# EAGLE design bread-supply_v0 (EAGLE 5.07)
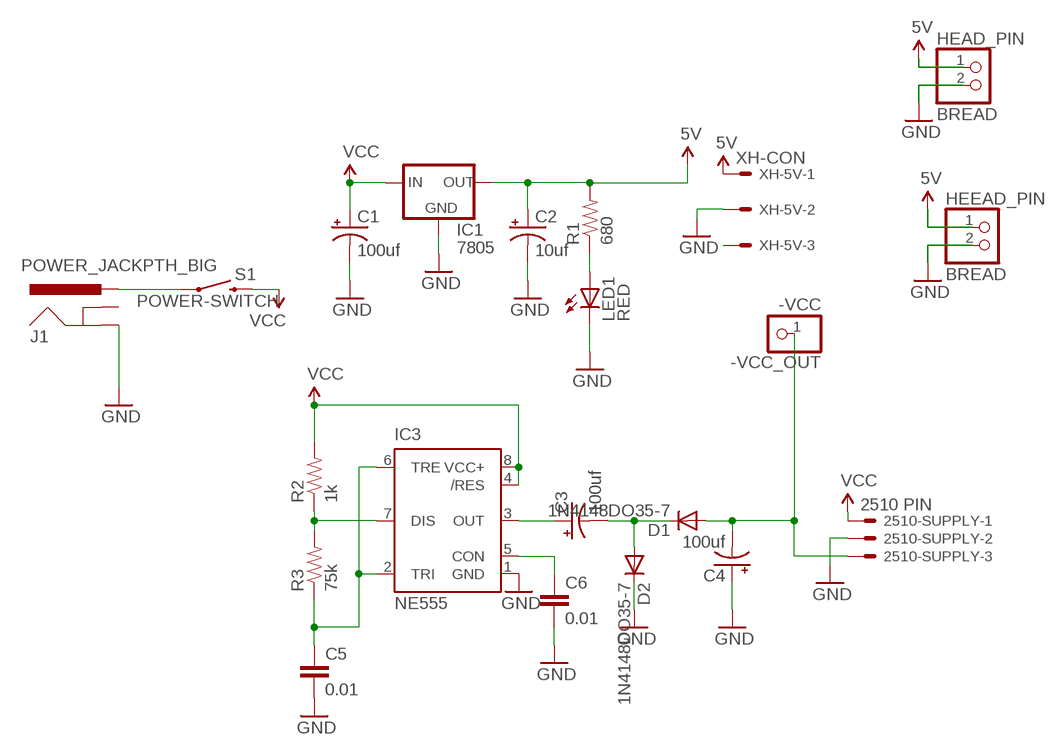
[diagram p0: schematic, sheet 1]

## Parts
2510-SUPPLY  2510 PIN  22-23-2031  [22-23-2031]
-VCC_OUT  -VCC  PINHD-1X1  [1X01]
C1  100uf  CAP_POLPTH1  [CPOL-RADIAL-100UF-25V]
C2  10uf  CAP_POLPTH2  [CPOL-RADIAL-10UF-25V]
C3  100uf  CAP_POLPTH1  [CPOL-RADIAL-100UF-25V]
C4  100uf  CAP_POLPTH1  [CPOL-RADIAL-100UF-25V]
C5  0.01  CAPPTH  [CAP-PTH-SMALL]
C6  0.01  CAPPTH  [CAP-PTH-SMALL]
D1  1N4148DO35-7  [DO35-7]
D2  1N4148DO35-7  [DO35-7]
HEAD_PIN  BREAD  PINHD-1X2  [1X02]
HEEAD_PIN  BREAD  PINHD-1X2  [1X02]
IC1  7805  V_REG_78XXSIDE  [78XXL]
IC3  NE555  [DIL-08]
J1  POWER_JACKPTH_BIG  [POWER_JACK_2.1X5.5_BIG_PTH]
LED1  RED  LED3MM  [LED3MM]
R1  680  RESISTORPTH1  [AXIAL-0.3]
R2  1k  RESISTORPTH1  [AXIAL-0.3]
R3  75k  RESISTORPTH1  [AXIAL-0.3]
S1  POWER-SWITCH  [POWER_CYLINDER_SWITCH]
XH-5V  XH-CON  22-27-2031-03  [6410-03]

## Nets
5V: C2.1(+) HEAD_PIN.1 HEEAD_PIN.1 IC1.OUT R1.P$2 XH-5V.1
GND: 2510-SUPPLY.2 C1.2(-) C2.2(-) C4.1(+) C5.2 C6.2 D2.C HEAD_PIN.2 HEEAD_PIN.2 IC1.GND IC3.1(GND) J1.GND LED1.K(C) XH-5V.2
N$1: J1.PWR S1.1
N$2: IC3.7(DIS) R2.P$1 R3.P$2
N$3: C5.1 IC3.2(TRI) IC3.6(TRE) R3.P$1
N$5: C6.1 IC3.5(CON)
N$6: C3.1(+) IC3.3(OUT)
N$7: C3.2(-) D1.C D2.A
N$8: 2510-SUPPLY.3 -VCC_OUT.1 C4.2(-) D1.A
N$10: LED1.A R1.P$1
VCC: 2510-SUPPLY.1 C1.1(+) IC1.IN IC3.4(/RES) IC3.8(VCC+) R2.P$2 S1.4
Unconnected: J1.GNDBREAK XH-5V.3

## Library data of the parts
2510-SUPPLY = con-molex:22-23-2031: .100" (2.54mm) Center Header - 3 Pin
-VCC_OUT = pinhead:PINHD-1X1: PIN HEADER
C1-C4 = SparkFun:CAP_POL: Capacitor Polarized These are standard SMD and PTH capacitors. Normally 10uF, 47uF, and 100uF in electrolytic and tantalum varieties. Always verify the external diameter of the through hole cap, it varies with capacity, voltage, and manufacturer. The EIA devices should be standard.
C5 C6 = SparkFun:CAP: Capacitor Standard 0603 ceramic capacitor, and 0.1" leaded capacitor.
D1 D2 = diode:1N4148: DIODE high speed (Philips)
HEAD_PIN HEEAD_PIN = pinhead:PINHD-1X2: PIN HEADER
IC1 = SparkFun:V_REG_78XX: Voltage Regulator Standard 7805 5V regulator. IGO (Input Ground Output). Spark Fun Electronics SKU : COM-00107
IC3 = st-microelectronics:NE555: General purpose bipolar Timer
J1 = digital-toy:POWER_JACK: Power Jack This is the standard 5.5mm barrel jack for power. The PTH is the most common, proven, reliable, footprint. All others are experimental. The Slot footprint only works if the mill layer is transmitted to the PCB fab house so be warned. Spark Fun Electronics SKU : PRT-00119. Mating wall wart : TOL-00298 (and others)
LED1 = SparkFun:LED: LEDs Standard schematic elements and footprints for 5mm, 3mm, 1206, and 0603 sized LEDs. 5mm - Spark Fun Electronics SKU : COM-00529 (and others)
R1-R3 = SparkFun:RESISTOR: Resistor Basic schematic elements and footprints for 0603, 1206, and PTH 1/10th watt (small) resistors.
S1 = digital-toy:POWER-SWITCH: Just a button to turn on the Power and with lock function
XH-5V = con-molex:22-?-03: CONNECTOR wire to board 2.54 mm (.1 inch) pitch header

## Board
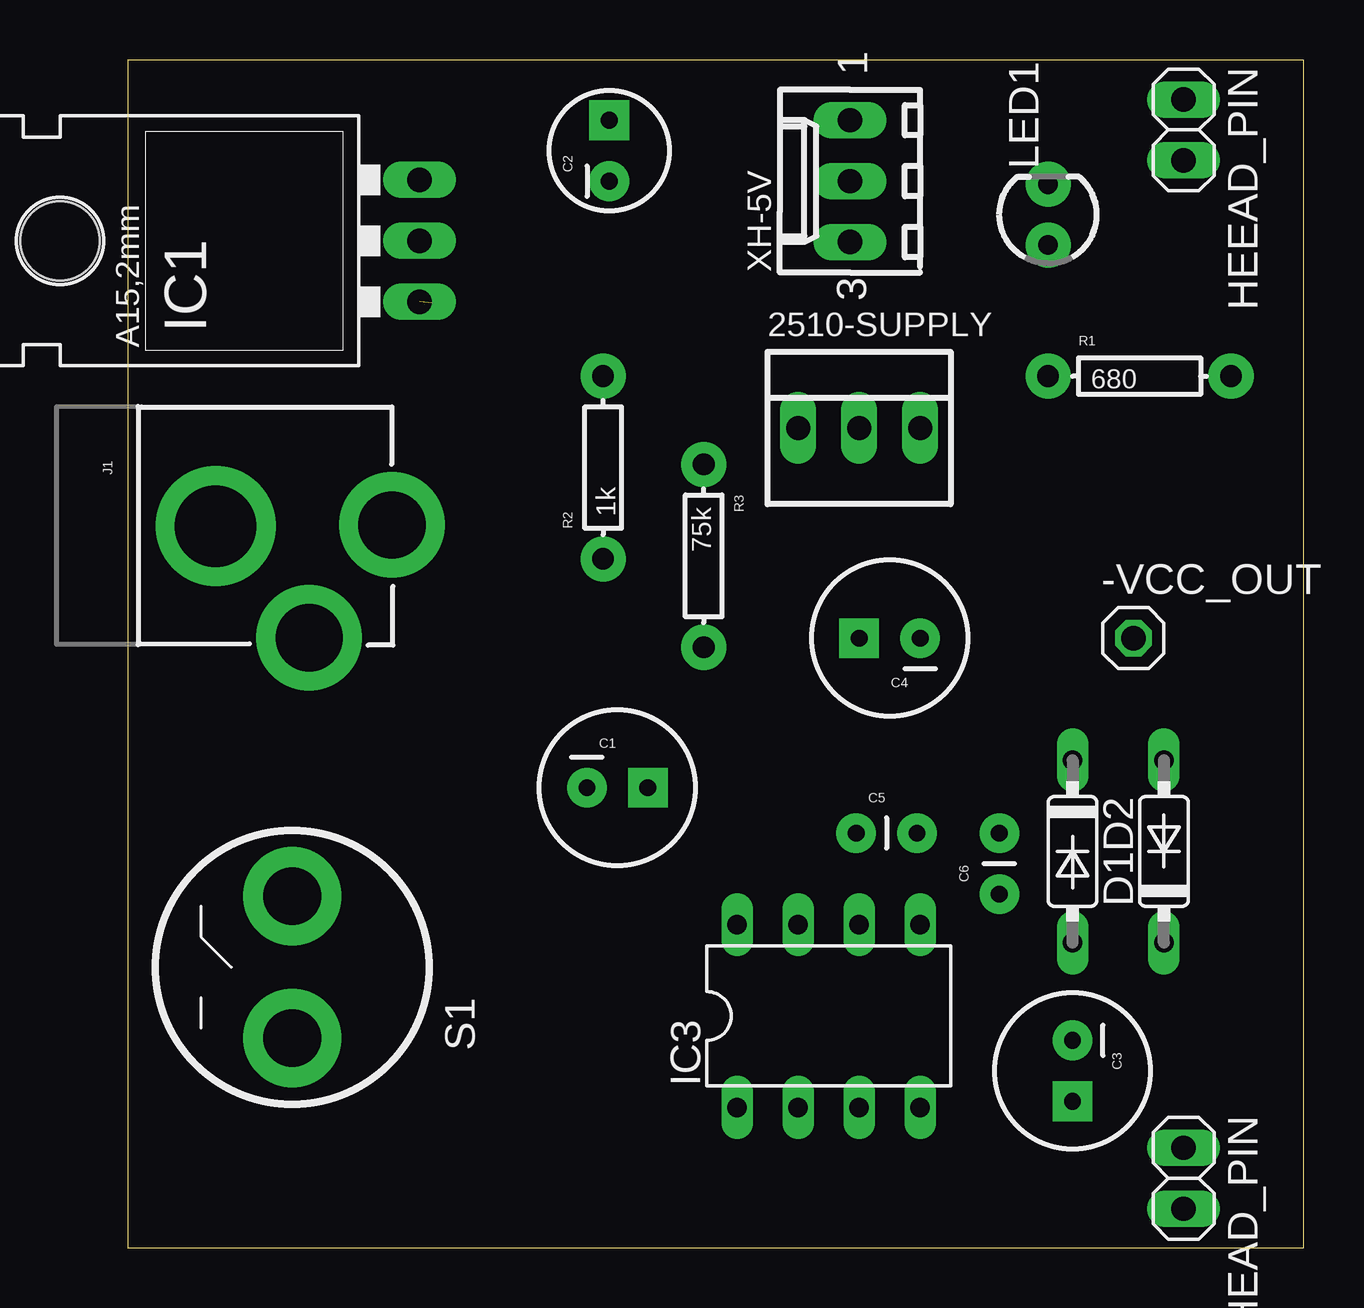
[diagram p1: board, top side]
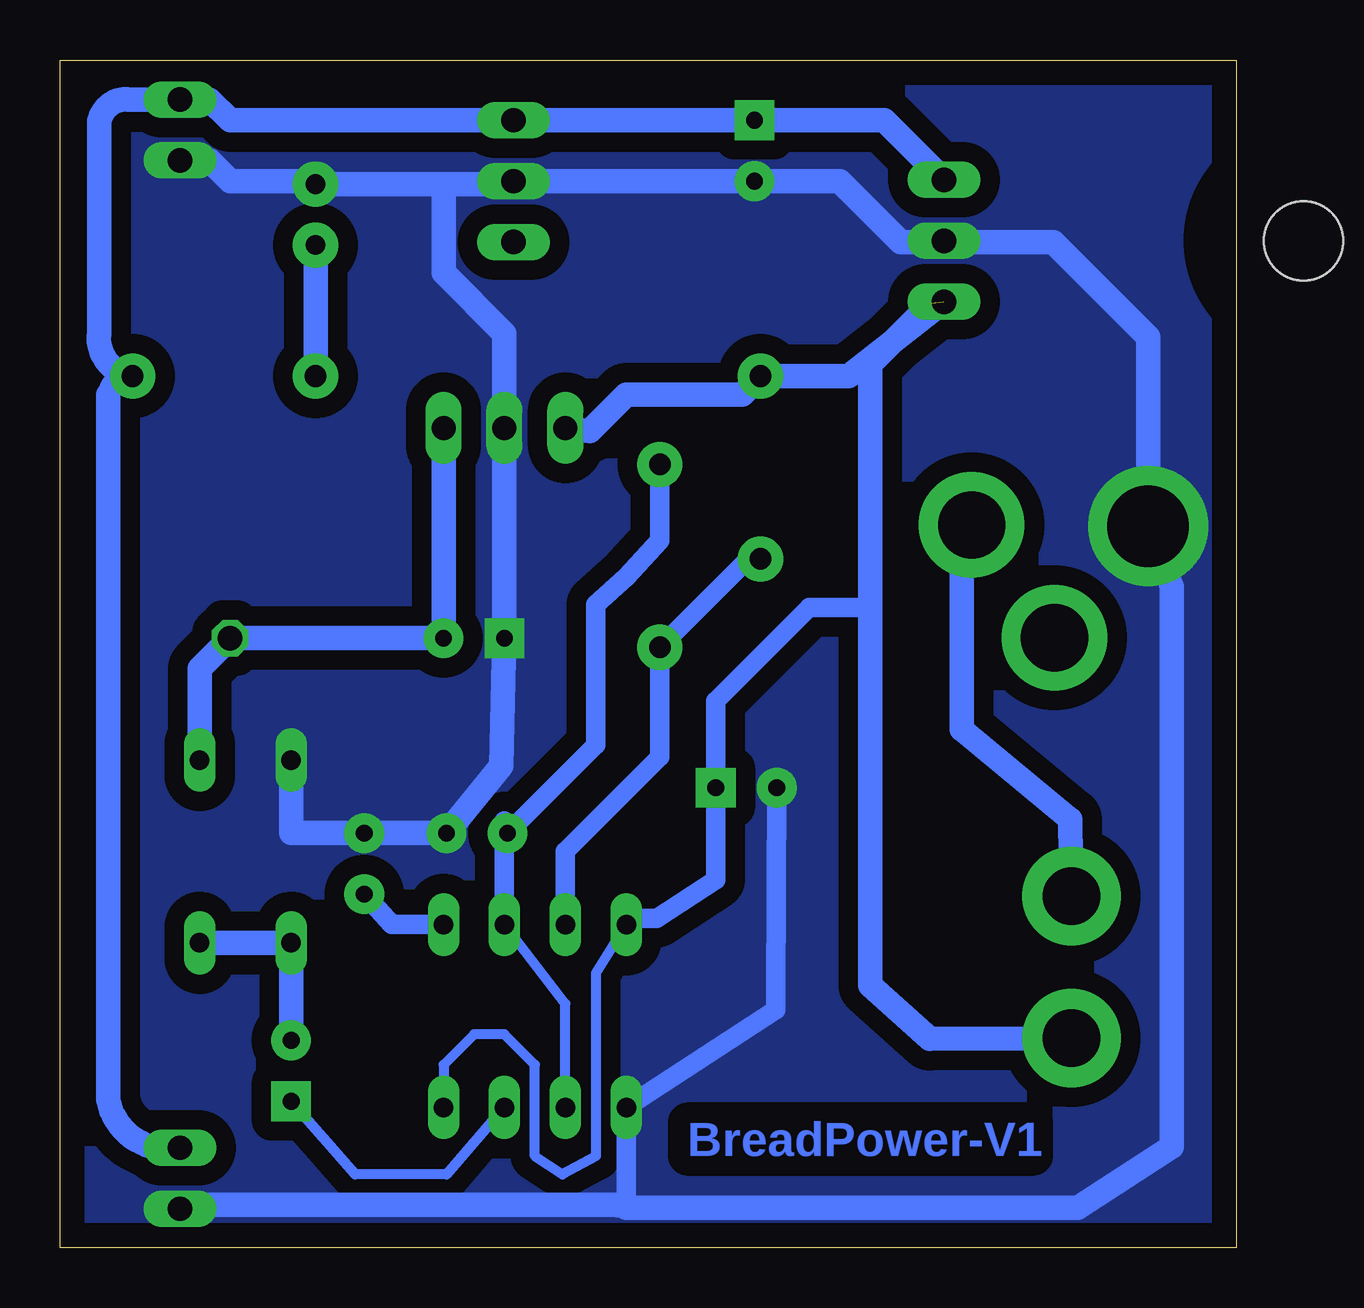
[diagram p2: board, bottom side, seen from below]

Size 49 x 49.5 mm. Coordinates in mm from the lower left corner, seen from the top.
Outline: 0,0 49,0 49,49.5 0,49.5 0,0
Copper layers (1*16): Top 0.035mm / dielectric 1.5mm / Bottom 0.035mm
Design rules "default": minimum track width 10mil, minimum drill 24mil, track to track 8mil, track to pad 8mil, pad to pad 8mil, via to via 8mil, smd to smd 8mil, copper to edge 40mil, drill to drill 8mil, minimum pad ring 10mil, minimum via ring 8mil, stop-mask expansion 4mil, vias tented up to drill 0mil, thermal gap 10mil

### Footprints (pad centres in the part's own frame; a part is rotated, then mirrored left to right if it is on the bottom)
22-23-2031 = drill 1 long: 1 -2.54,0; 2 0,0; 3 2.54,0
1X01 = drill 1.016 octagon: 1 0,0
CPOL-RADIAL-100UF-25V = drill 0.7 pad 1.651 square: 1 1.27,0 | drill 0.7 pad 1.651 round: 2 -1.27,0
CPOL-RADIAL-10UF-25V = drill 0.7 pad 1.651 square: 1 1.27,0 | drill 0.7 pad 1.651 round: 2 -1.27,0
CAP-PTH-SMALL = drill 0.7 pad 1.651 round: 1 0,0; 2 2.54,0
DO35-7 = drill 0.813 long: A 3.81,0; C -3.81,0
1X02 = drill 1.016 long: 1 -1.27,0; 2 1.27,0
78XXL = drill 1.016 long: GND 0,-3.81; IN -2.54,-3.81; OUT 2.54,-3.81 | hole 3.302: 0,11.176
DIL-08 = drill 0.813 long: 1 -3.81,-3.81; 2 -1.27,-3.81; 3 1.27,-3.81; 4 3.81,-3.81; 5 3.81,3.81; 6 1.27,3.81; 7 -1.27,3.81; 8 -3.81,3.81
POWER_JACK_2.1X5.5_BIG_PTH = drill 3.4 pad 5 round: GND -0.053,7.35 | drill 2.8 pad 4.4 round: GNDBREAK -4.7,3.451; PWR 0,0
LED3MM = drill 0.813 pad 1.88 round: A -1.27,0; K 1.27,0
AXIAL-0.3 = drill 0.9 pad 1.88 round: P$1 -3.81,0; P$2 3.81,0
POWER_CYLINDER_SWITCH = drill 2.4 pad 4.1 round: 1 -2.96,0; 4 2.96,0
6410-03 = drill 1.016 long: 1 2.54,0; 2 0,0; 3 -2.54,0

### Placement (x,y rotation side)
2510-SUPPLY  30.48,34.16 0 top
-VCC_OUT  41.91,25.4 0 top
C1  20.41,19.16 0 top
C2  20.07,45.72 90 top
C3  39.37,7.37 270 top
C4  31.75,25.4 180 top
C5  30.35,17.27 0 top
C6  36.32,14.73 90 top
D1  43.18,16.51 90 top
D2  39.37,16.51 270 top
HEAD_PIN  44,2.89 270 top
HEEAD_PIN  44,46.58 270 top
IC1  8.36,41.96 90 top
IC3  29.21,9.65 0 top
J1  11.01,30.12 90 top
LED1  38.35,43.05 90 top
R1  42.16,36.32 0 top
R2  19.81,32.51 90 top
R3  24,28.83 270 top
S1  6.86,11.68 270 top
XH-5V  30.1,44.45 90 top

### Tracks (layer width: path | path; a pad name or v marks a point on that pad's centre or on a via)
5V
  Bottom 0.813: R1.P$2 46.23,36.32 arc-90 46.99,35.56
  Bottom 1.016: IC1.OUT 14.65,46.99 C2.1 XH-5V.1 41.91,46.99 42.77,47.85 HEEAD_PIN.1 46.13,47.85 arc-90 47.37,46.86 47.37,38.1 arc-90 R1.P$2 | 46.99,35.56 46.99,6.15 arc-90 HEAD_PIN.1
GND
  Bottom 0.254: 19.18,9.91 19.05,10.16
  Bottom 0.406: IC1.GND 12.12,41.91
  Bottom 0.61: 43.91,1.78 HEAD_PIN.2 | 25.4,1.65 25.78,1.65
  Bottom 0.813: C1.2 19.18,10.54 19.18,9.91 IC3.1 25.4,1.65 | 12.22,41.91 IC1.GND | XH-5V.2 30.23,44.32 | LED1.K 38.73,44.45 | 25.78,1.65 25.91,1.78
  Bottom 1.016: XH-5V.2 C2.2 16.51,44.45 13.97,41.91 12.22,41.91 7.62,41.91 3.66,37.95 J1.GND 2.67,27.56 2.67,4.19 6.6,1.65 25.4,1.65 | 30.23,44.32 33.02,44.32 | 33.02,44.32 LED1.K | 38.73,44.45 41.91,44.45 42.77,45.31 HEEAD_PIN.2 | 33.02,44.32 33.02,40.64 30.48,38.1 2510-SUPPLY.2 C4.1 30.61,20.07 C5.2 C6.2 39.37,17.27 D2.C | 25.91,1.78 43.91,1.78
  pour Bottom (isolate 0.813, no thermals): -7.62,50.8 58.42,50.8 58.42,-11.43 -5.08,-11.43 -10.16,-6.35 -10.16,48.26
N$1
  Bottom 1.016: J1.PWR 11.43,29.45 11.43,21.59 6.92,17.84 S1.1
N$2
  Bottom 0.813: IC3.7 27.94,16.51 24,20.45 R3.P$2 20.32,28.7 R2.P$1
N$3
  Bottom 0.406: IC3.2 27.94,10.16 IC3.6
  Bottom 0.813: 30.48,17.4 C5.1 26.67,20.95 26.67,26.8 25.4,27.94 24,29.46 R3.P$1 | 30.48,17.4 30.48,17.78 | IC3.6 30.48,17.4
N$5
  Bottom 0.813: C6.1 35.18,13.46 IC3.5
N$6
  Bottom 0.406: IC3.3 32.89,3.05 36.7,3.05 C3.1
N$7
  Bottom 1.016: D1.C D2.A C3.2
N$8
  Bottom 1.016: 2510-SUPPLY.3 C4.2 -VCC_OUT.1 43.18,24.13 D1.A
N$10
  Bottom 1.016: R1.P$1 LED1.A
VCC  (1 unrouted)
  Bottom 0.406: IC3.8 26.67,11.43 26.67,3.81 28.07,3.05 29.21,3.81 29.21,7.62 30.48,8.89 31.75,8.89 33.02,7.62 IC3.4
  Bottom 0.813: IC3.8 25.4,13.72 24.13,13.72 21.68,15.33 C1.1 21.68,22.77 17.78,26.67 15.24,26.67
  Bottom 1.016: IC1.IN 16.13,36.32 R2.P$2 20.57,35.56 25.4,35.56 26.92,34.04 2510-SUPPLY.1 | S1.4 12.77,8.71 15.24,10.92 15.24,26.67 15.24,36.83 12.7,39.37

### Text on the board
Bottom: BreadPower-V1